# Altium project MHE_Tracker_V3.PrjPcb
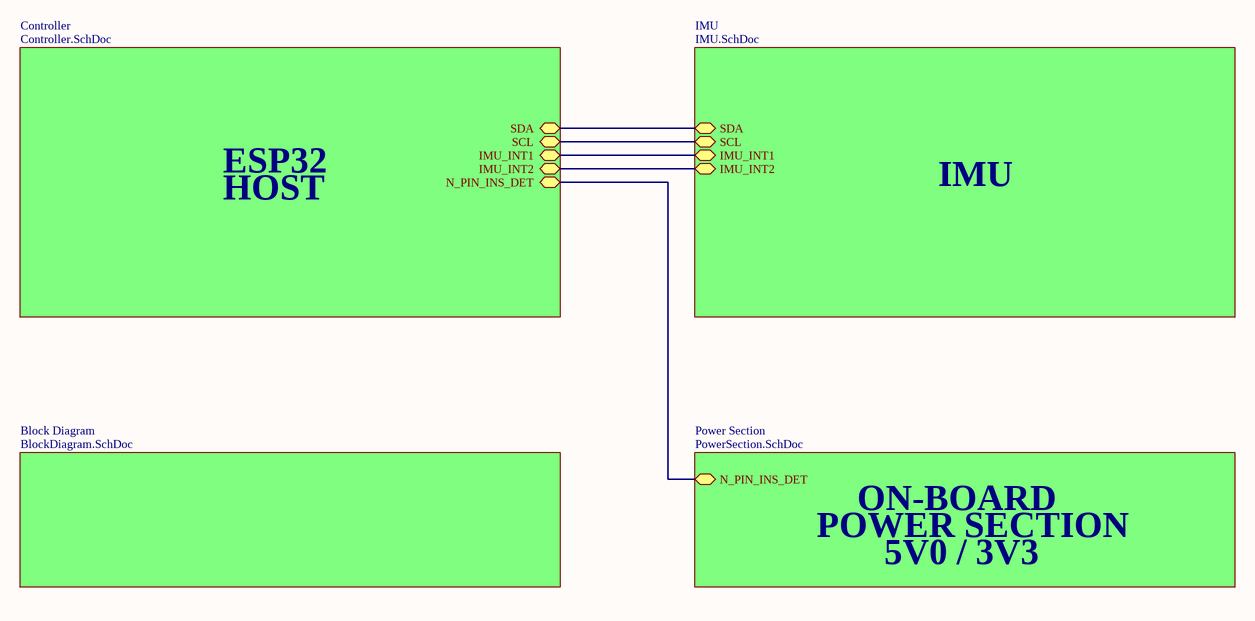
[diagram p0: Architecture.SchDoc]
Project: MHE Tracker V3; Revision: 1.0; SheetTotal: 5
5 sheets, 137 parts. Net scope: hierarchical (ports join the sheet entries above them; power ports are global).
Board file: MHE_Tracker_V3.PcbDoc
Sheets:
  Architecture.SchDoc
    Controller = Controller.SchDoc
    Power Section = PowerSection.SchDoc
    Block Diagram = BlockDiagram.SchDoc
    IMU = IMU.SchDoc

## Sheet Architecture.SchDoc: System Architecture
size 420 x 297 mm; SheetNumber: 1; SheetTotal: 2; DOC_NO_SCH_DWG: 1

### Sub-sheets
Block Diagram = BlockDiagram.SchDoc: no entries
Controller = Controller.SchDoc: SDA (bidir), SCL (bidir), IMU_INT1 (bidir), IMU_INT2 (bidir), N_PIN_INS_DET (bidir)
IMU = IMU.SchDoc: SDA (bidir), SCL (bidir), IMU_INT1 (bidir), IMU_INT2 (bidir)
Power Section = PowerSection.SchDoc: N_PIN_INS_DET (bidir)

### Nets
IMU_INT1: sheet Controller/IMU_INT1, sheet IMU/IMU_INT1
IMU_INT2: sheet Controller/IMU_INT2, sheet IMU/IMU_INT2
N_PIN_INS_DET: sheet Controller/N_PIN_INS_DET, sheet Power Section/N_PIN_INS_DET
SCL: sheet Controller/SCL, sheet IMU/SCL
SDA: sheet Controller/SDA, sheet IMU/SDA

### Notes on the sheet
- HOST
- ESP32
- IMU
- POWER SECTION
- ON-BOARD
- 5V0 / 3V3
- PROJECT
- SIZE
- FILE NAME
- A3
- TITLE
- SHEET
- OF
- REV

## Sheet Controller.SchDoc: Controller Section
size 420 x 297 mm; SheetNumber: 2
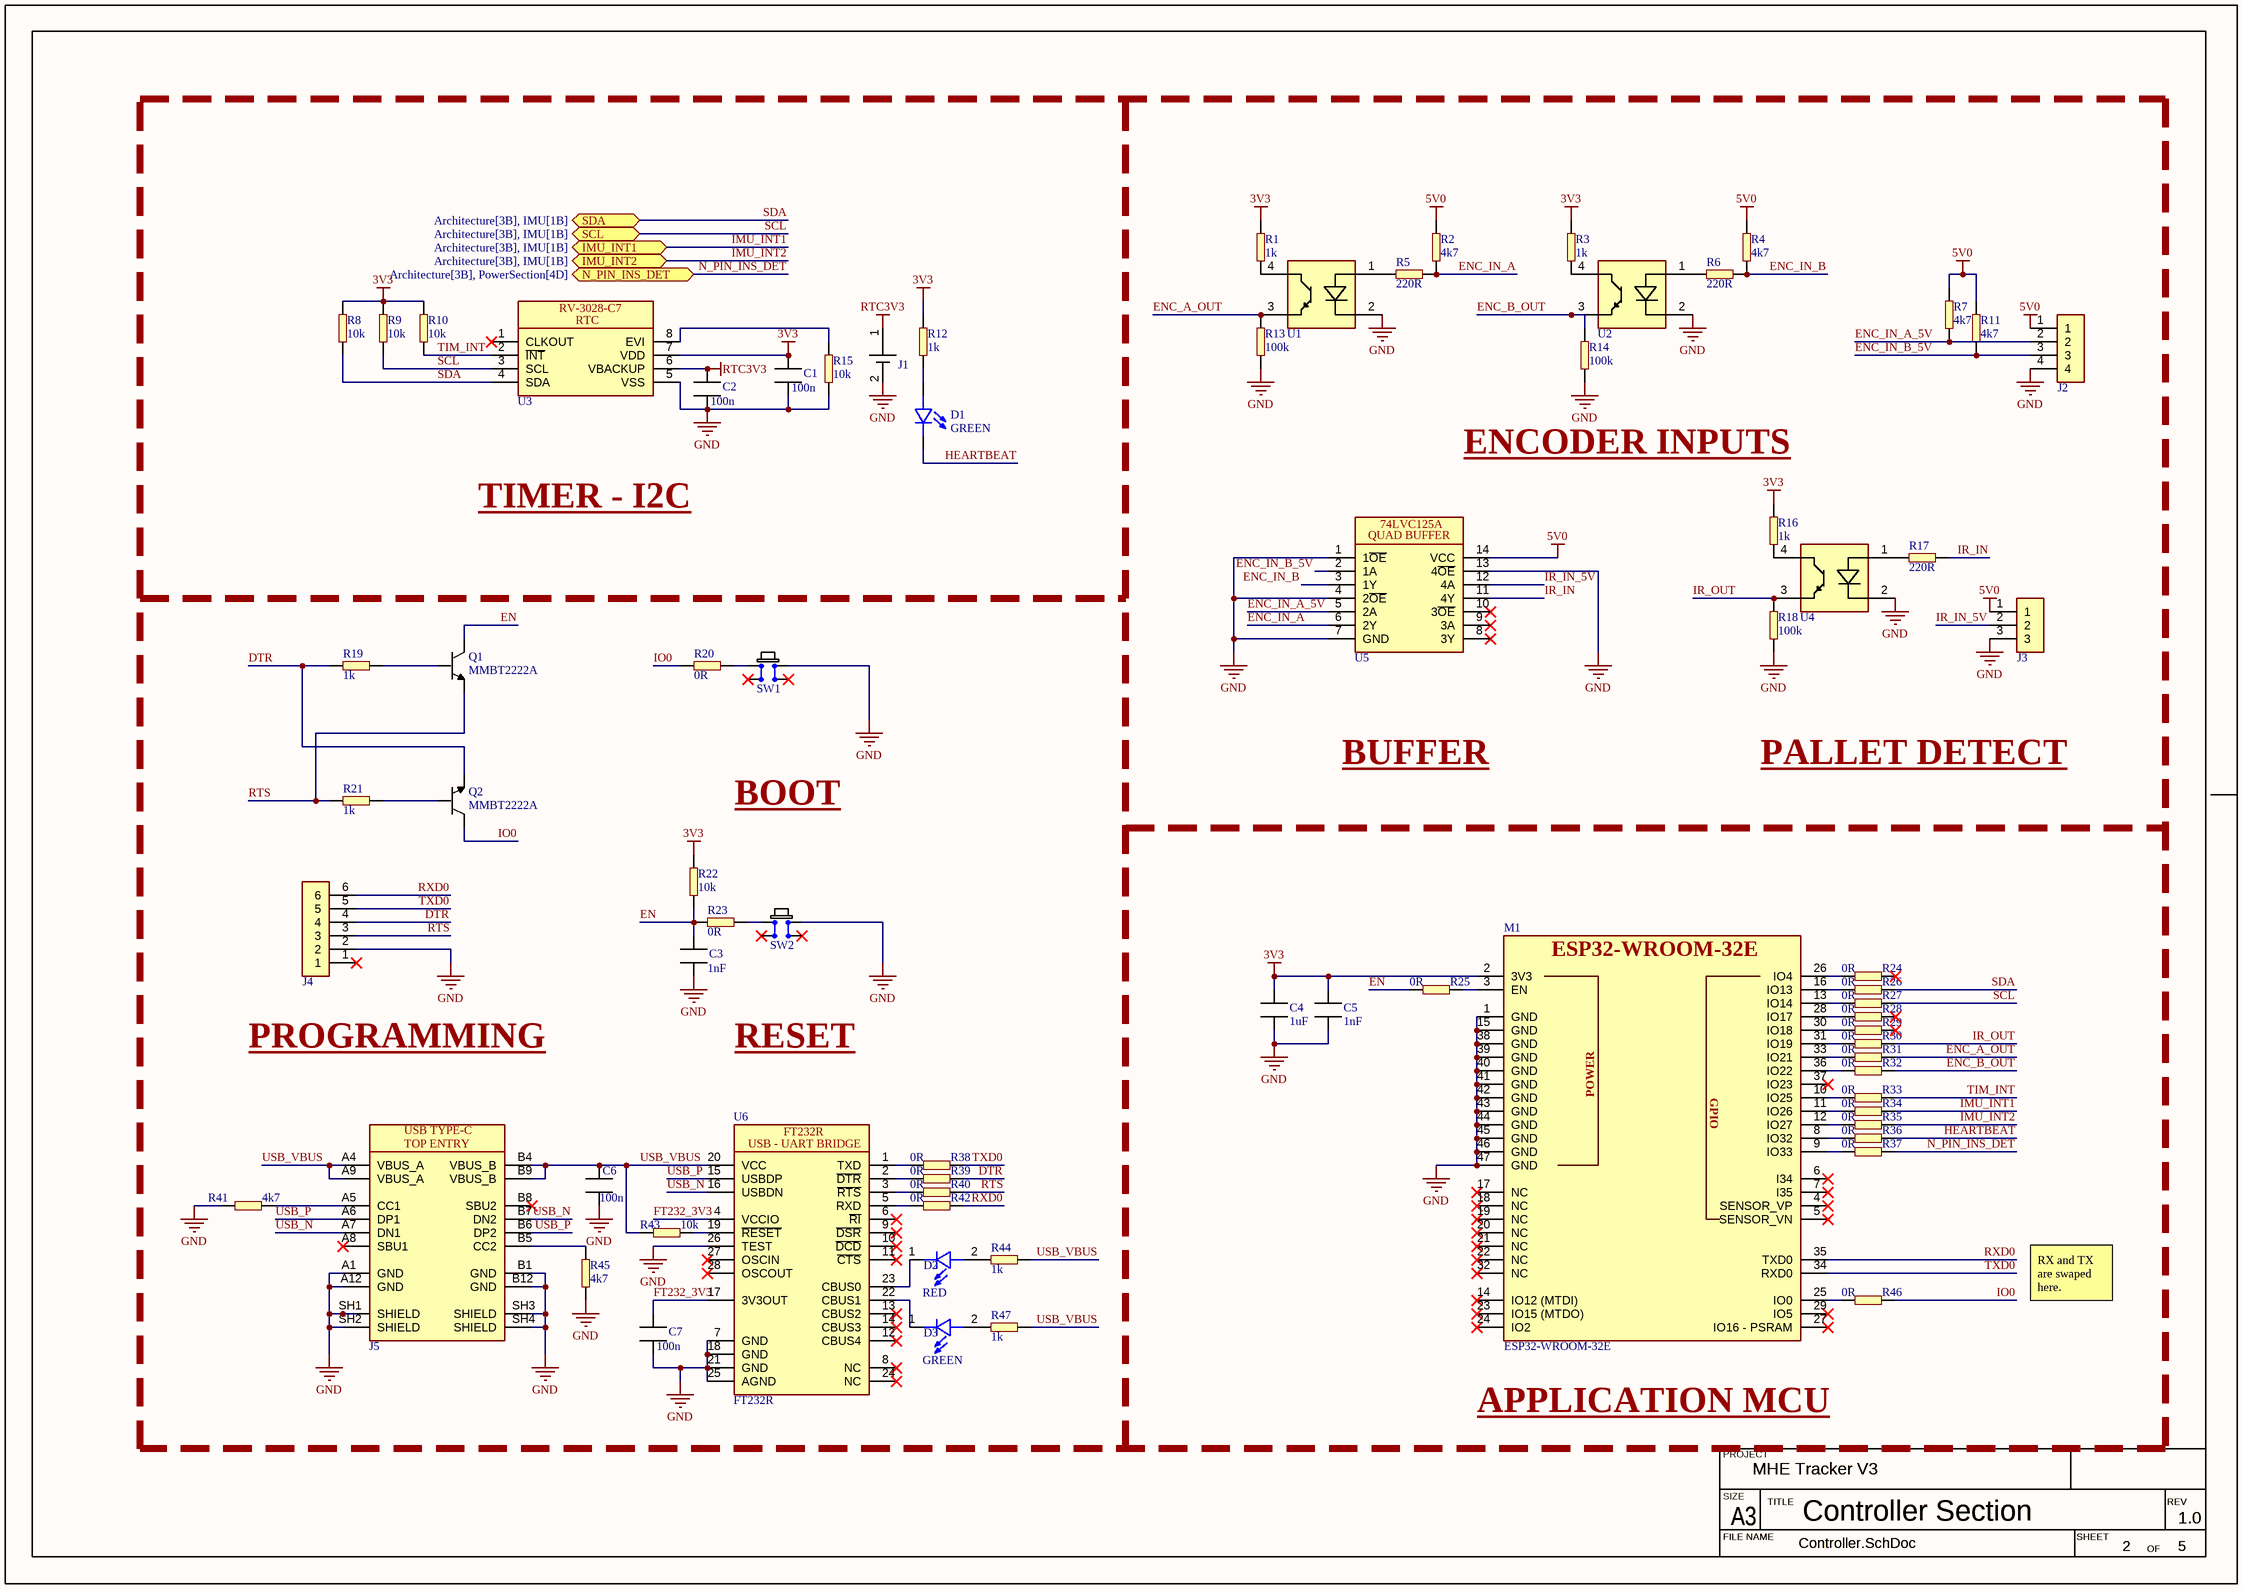
[diagram p1: Controller.SchDoc]

### Parts
(Parts that share a designator on the sheet are numbered #1, #2 ... from top to bottom, then left to right.)
C1  value 100n  [CAPC1608X10N]  (hidden comment: ERP_102-1)
C2  value 100n  [CAPC1608X10N]  (hidden comment: ERP_102-1)
C3  value 1nF  [CAPC1608X10N]  (hidden comment: ERP_102-1)
C4  value 1uF  [CAPC1608X10N]  (hidden comment: ERP_102-1)
C5  value 1nF  [CAPC1608X10N]  (hidden comment: ERP_102-1)
C6  value 100n  [CAPC1608X10N]  (hidden comment: ERP_102-1)
C7  value 100n  [CAPC1608X10N]  (hidden comment: ERP_102-1)
D1  value GREEN  [LED_3MM_GREEN_RIGHT_ANGLE]  (hidden comment: LED_3MM_RIGHT_ANGLE)
D2  value RED  [LED_1206]  (hidden comment: LED_1206)
D3  value GREEN  [LED_1206]  (hidden comment: LED_1206)
J1  CR1220-BH  [CR1220-BH]  (value not drawn)
J2  Terminal_Block_4Pin_5.08P  [4Pin_TerminalBlock_5.08P]  (value not drawn)
J3  Terminal_Block_3Pin_5.08P  [3Pin_TerminalBlock_5.08P]  (value not drawn)
J4  ERP_148-2  [6PX1R_F]  (value not drawn)
J5  GSB1CA11101DSHR  [GSB1CA11101DSHR]  (value not drawn)
M1  ESP32-WROOM-32E  [ESP32-WROOM-32E]
Q1  value MMBT2222A  [MMBT2222]  (hidden comment: ERP_105-1)
Q2  value MMBT2222A  [MMBT2222]  (hidden comment: ERP_105-1)
R1  value 1k  [RES_0603]  (hidden comment: ERP_101-1)
R2  value 4k7  [RES_0603]  (hidden comment: ERP_101-1)
R3  value 1k  [RES_0603]  (hidden comment: ERP_101-1)
R4  value 4k7  [RES_0603]  (hidden comment: ERP_101-1)
R5  value 220R  [RES_0603]  (hidden comment: ERP_101-1)
R6  value 220R  [RES_0603]  (hidden comment: ERP_101-1)
R7  value 4k7  [RES_0603]  (hidden comment: ERP_101-1)
R8  value 10k  [RES_0603]  (hidden comment: ERP_101-1)
R9  value 10k  [RES_0603]  (hidden comment: ERP_101-1)
R10  value 10k  [RES_0603]  (hidden comment: ERP_101-1)
R11  value 4k7  [RES_0603]  (hidden comment: ERP_101-1)
R12  value 1k  [RES_0603]  (hidden comment: ERP_101-1)
R13  value 100k  [RES_0603]  (hidden comment: ERP_101-1)
R14  value 100k  [RES_0603]  (hidden comment: ERP_101-1)
R15  value 10k  [RES_0603]  (hidden comment: ERP_101-1)
R16  value 1k  [RES_0603]  (hidden comment: ERP_101-1)
R17#1  value 220R  [RES_0603]  (hidden comment: ERP_101-1)
R18#1  value 100k  [RES_0603]  (hidden comment: ERP_101-1)
R19#1  value 1k  [RES_0603]  (hidden comment: ERP_101-1)
R20  value 0R  [RES_0603]  (hidden comment: ERP_101-1)
R21  value 1k  [RES_0603]  (hidden comment: ERP_101-1)
R22#1  value 10k  [RES_0603]  (hidden comment: ERP_101-1)
R23#1  value 0R  [RES_0603]  (hidden comment: ERP_101-1)
R24  value 0R  [RES_0603]  (hidden comment: ERP_101-1)
R25  value 0R  [RES_0603]  (hidden comment: ERP_101-1)
R26  value 0R  [RES_0603]  (hidden comment: ERP_101-1)
R27  value 0R  [RES_0603]  (hidden comment: ERP_101-1)
R28  value 0R  [RES_0603]  (hidden comment: ERP_101-1)
R29  value 0R  [RES_0603]  (hidden comment: ERP_101-1)
R30  value 0R  [RES_0603]  (hidden comment: ERP_101-1)
R31#1  value 0R  [RES_0603]  (hidden comment: ERP_101-1)
R32#1  value 0R  [RES_0603]  (hidden comment: ERP_101-1)
R33#1  value 0R  [RES_0603]  (hidden comment: ERP_101-1)
R34#1  value 0R  [RES_0603]  (hidden comment: ERP_101-1)
R35#1  value 0R  [RES_0603]  (hidden comment: ERP_101-1)
R36  value 0R  [RES_0603]  (hidden comment: ERP_101-1)
R37  value 0R  [RES_0603]  (hidden comment: ERP_101-1)
R38  value 0R  [RES_0603]  (hidden comment: ERP_101-1)
R39  value 0R  [RES_0603]  (hidden comment: ERP_101-1)
R40  value 0R  [RES_0603]  (hidden comment: ERP_101-1)
R41  value 4k7  [RES_0603]  (hidden comment: ERP_101-1)
R42  value 0R  [RES_0603]  (hidden comment: ERP_101-1)
R43  value 10k  [RES_0603]  (hidden comment: ERP_101-1)
R44  value 1k  [RES_0603]  (hidden comment: ERP_101-1)
R45  value 4k7  [RES_0603]  (hidden comment: ERP_101-1)
R46  value 0R  [RES_0603]  (hidden comment: ERP_101-1)
R47  value 1k  [RES_0603]  (hidden comment: ERP_101-1)
SW1  Generic6X6  [Generic6X6]  (value not drawn)
SW2  Generic6X6  [Generic6X6]  (value not drawn)
U1  FOD817A3SD  [FOD817A3SD]  (value not drawn)
U2  FOD817A3SD  [FOD817A3SD]  (value not drawn)
U3  RV-3028-C7  [RV-3028-C7]  (value not drawn)
U4#1  FOD817A3SD  [FOD817A3SD]  (value not drawn)
U5  74LVC125A  [SOIC127P600X175-14M]  (value not drawn)
U6#1  FT232R  [SOP65P780X200-28M]

### Ports
IMU_INT1 (bidir, see Architecture[3B], IMU[1B]), IMU_INT2 (bidir, see Architecture[3B], IMU[1B]), N_PIN_INS_DET (bidir, see Architecture[3B], PowerSection[4D]), SCL (bidir, see Architecture[3B], IMU[1B]), SDA (bidir, see Architecture[3B], IMU[1B])

### Nets
3V3: C1.1 C4.2 C5.2 M1.2(3V3) R1.2 R3.2 R8.2 R9.2 R10.2 R12.1 R16.2 R22#1.2 U3.7(VDD)
5V0: J2.1 J3.1 R2.2 R4.2 R7.1 R11.1 U5.14(VCC)
GND: C1.2 C2.2 C3.2 C4.1 C5.1 C6.2 C7.2 J1.2(-) J2.4 J3.3 J4.2 J5.A1(GND) J5.A12(GND) J5.B1(GND) J5.B12(GND) J5.SH1(SHIELD) J5.SH2(SHIELD) J5.SH3(SHIELD) J5.SH4(SHIELD) M1.1(GND) M1.15(GND) M1.38(GND) M1.39(GND) M1.40(GND) M1.41(GND) M1.42(GND) M1.43(GND) M1.44(GND) M1.45(GND) M1.46(GND) M1.47(GND) R13.1 R14.1 R15.1 R18#1.1 R41.2 R45.2 SW1.3(COM) SW2.3(COM) U1.2(CATHODE) U2.2(CATHODE) U3.5(VSS) U4#1.2(CATHODE) U5.1(1~{OE}) U5.4(2~{OE}) U5.7(GND) U5.13(4~{OE}) U6#1.7(GND) U6#1.18(GND) U6#1.21(GND) U6#1.25(AGND) U6#1.26(TEST)
RTC3V3: C2.1 J1.1(+) U3.6(VBACKUP)
DTR: J4.4 Q2.2 R19#1.2 R39.1
EN: C3.1 Q1.3 R22#1.1 R23#1.2 R25.2
ENC_A_OUT: R13.2 R31#1.1 U1.3(EMITTER)
ENC_B_OUT: R14.2 R32#1.1 U2.3(EMITTER)
ENC_IN_A: R2.1 R5.2 U5.6(2Y)
ENC_IN_A_5V: J2.2 R7.2 U5.5(2A)
ENC_IN_B: R4.1 R6.2 U5.3(1Y)
ENC_IN_B_5V: J2.3 R11.2 U5.2(1A)
FT232_3V3: C7.1 U6#1.4(VCCIO) U6#1.17(3V3OUT)
HEARTBEAT: D1.2 R36.1
IMU_INT1: R34#1.1 ; port IMU_INT1
IMU_INT2: R35#1.2 ; port IMU_INT2
IO0: Q2.3 R20.2 R46.1
IR_IN: R17#1.2 U5.11(4Y)
IR_IN_5V: J3.2 U5.12(4A)
IR_OUT: R18#1.2 R30.1 U4#1.3(EMITTER)
N_PIN_INS_DET: R37.1 ; port N_PIN_INS_DET
RTS: J4.3 Q1.2 R21.2 R40.1
RXD0: J4.6 M1.35(TXD0) R42.1
SCL: R9.1 R27.1 U3.3(SCL) ; port SCL
SDA: R8.1 R26.1 U3.4(SDA) ; port SDA
TIM_INT: R10.1 R33#1.1 U3.2(~{INT})
TXD0: J4.5 M1.34(RXD0) R38.1
USB_N: J5.A7(DN1) J5.B7(DN2) U6#1.16(USBDN)
USB_P: J5.A6(DP1) J5.B6(DP2) U6#1.15(USBDP)
USB_VBUS: C6.1 J5.A4(VBUS_A) J5.A9(VBUS_A) J5.B4(VBUS_B) J5.B9(VBUS_B) R43.1 R44.2 R47.2 U6#1.20(VCC)
NetD1_1: D1.1 R12.2
NetD2_1: D2.1 U6#1.23(CBUS0)
NetD2_2: D2.2 R44.1
NetD3_1: D3.1 U6#1.22(CBUS1)
NetD3_2: D3.2 R47.1
NetJ5_A5: J5.A5(CC1) R41.1
NetJ5_B5: J5.B5(CC2) R45.1
NetM1_3: M1.3(EN) R25.1
NetM1_8: M1.8(IO32) R36.2
NetM1_9: M1.9(IO33) R37.2
NetM1_10: M1.10(IO25) R33#1.2
NetM1_11: M1.11(IO26) R34#1.2
NetM1_12: M1.12(IO27) R35#1.1
NetM1_13: M1.13(IO14) R27.2
NetM1_16: M1.16(IO13) R26.2
NetM1_25: M1.25(IO0) R46.2
NetM1_26: M1.26(IO4) R24.2
NetM1_28: M1.28(IO17) R28.2
NetM1_30: M1.30(IO18) R29.2
NetM1_31: M1.31(IO19) R30.2
NetM1_33: M1.33(IO21) R31#1.2
NetM1_36: M1.36(IO22) R32#1.2
NetQ1_1: Q1.1 R19#1.1
NetQ2_1: Q2.1 R21.1
NetR1_1: R1.1 U1.4(COLLECTOR)
NetR3_1: R3.1 U2.4(COLLECTOR)
NetR5_1: R5.1 U1.1(ANODE)
NetR6_1: R6.1 U2.1(ANODE)
NetR15_2: R15.2 U3.8(EVI)
NetR16_1: R16.1 U4#1.4(COLLECTOR)
NetR17#1_1: R17#1.1 U4#1.1(ANODE)
NetR20_1: R20.1 SW1.1(NO)
NetR23#1_1: R23#1.1 SW2.1(NO)
NetR38_2: R38.2 U6#1.1(TXD)
NetR39_2: R39.2 U6#1.2(~{DTR})
NetR40_2: R40.2 U6#1.3(~{RTS})
NetR42_2: R42.2 U6#1.5(RXD)
NetR43_2: R43.2 U6#1.19(~{RESET})

Not connected (* = marked no-connect by the designer): J4 1*; J5 A8(SBU1)* B8(SBU2)*; M1 4(SENSOR_VP)* 5(SENSOR_VN)* 6(I34)* 7(I35)* 14(IO12_(MTDI))* 17(NC)* 18(NC)* 19(NC)* 20(NC)* 21(NC)* 22(NC)* 23(IO15_(MTDO))* 24(IO2)* 27(IO16_-_PSRAM)* 29(IO5)* 32(NC)* 37(IO23)*; R24 1*; R28 1*; R29 1*; SW1 2(NO)* 4(COM)*; SW2 2(NO)* 4(COM)*; U3 1(CLKOUT)*; U5 8(3Y)* 9(3A)* 10(3~{OE})*; U6#1 6(~{RI})* 8(NC)* 9(~{DSR})* 10(~{DCD})* 11(~{CTS})* 12(CBUS4)* 13(CBUS2)* 14(CBUS3)* 24(NC)* 27(OSCIN)* 28(OSCOUT)*

### Notes on the sheet
- ENCODER INPUTS
- TIMER - I2C
- BUFFER
- PALLET DETECT
- BOOT
- PROGRAMMING
- RESET
- RX and TX are swaped here.
- APPLICATION MCU
- PROJECT
- SIZE
- FILE NAME
- A3
- TITLE
- SHEET
- OF
- REV
- (in symbol 74LVC125A) QUAD BUFFER
- (in symbol ESP32-WROOM-32E) POWER; GPIO
- (in symbol FT232R) USB - UART BRIDGE
- (in symbol GSB1CA11101DSHR) USB TYPE-C; TOP ENTRY
- (in symbol RV-3028-C7) RTC

### Library data of the parts
C1 C2 C6 C7 = MLCC_0603: MLCC 0603; Package: 0603; Manufacturer Part Number 1: *; Suuplier Part Number 1: *; ERP: *
  C2: Manufacturer 1: *
C3 = MLCC_0603: MLCC 0603; Manufacturer 1: Samsung Electro-Mechanics; Manufacturer Part Number 1: CL10C102JB8NNNC; Package: 0603; Suuplier Part Number 1: *; ERP: *; Supplier 1: Digikey; Supplier Part Number 1: 1276-1091-1-ND
C4 C5 = MLCC_0603: MLCC 0603; Manufacturer 1: Samsung Electro-Mechanics; Manufacturer Part Number 1: CL10A105KB8NNNC; Package: 0603; Supplier 1: *; Suuplier Part Number 1: *; ERP: *
D1 = LED_3MM_RIGHT_ANGLE: LED_3MM
D2 D3 = LED_1206: LED CLEAR 1206 SMD; Manufacturer Part Number 1: *; Manufacturer 1: *
J1 = CR1220-BH: BATTERY HOLDER COIN 12.5MM SMD; Manufacturer 1: Keystone Electronics; Value: *; Manufacturer Part Number 1: *
J2 = Terminal_Block_4Pin_5.08P: 6PINS TERMINAL BLOCK 5.08 PITCH; Manufacturer Part Number 1: *; Manufacturer 1: *; Supplier Part Number 1: *; Supplier 1: *; ERP: *; Package: 6PIN
J3 = Terminal_Block_3Pin_5.08P: 6PINS TERMINAL BLOCK 5.08 PITCH; Manufacturer Part Number 1: *; Manufacturer 1: *; Supplier Part Number 1: *; Supplier 1: *; ERP: *; Package: 6PIN
J4 = 6PX1R_F: 6PX1R Female Header; Value: *; Manufacturer 1: *; Manufacturer Part Number 1: *
J5 = GSB1CA11101DSHR: USB-C (USB TYPE-C) USB 2.0 Receptacle Connector 24 (16+8 Dummy) Position Surface Mount, Through Hole; Manufacturer 1: Amphenol ICC (Commercial Products); Value: MUP-U23010-02; Manufacturer Part Number 1: GSB1CA11101DSHR; Package: 24 (16+8 Dummy)
M1 = ESP32-WROOM-32E: ESP32-WROOM-32E Module; Manufacturer 1: Espressif Systems; Manufacturer Part Number 1: *; Package: *; Value: ESP32-WROOM-32E
Q1 Q2 = MMBT2222: MMBT2222A; Manufacturer Part Number 1: MMBT2222A-7-F; Manufacturer 1: Diotec Semiconductor; ERP: *; Suuplier Part Number 1: *; Supplier 1: *; Package: SOT23
R1-R7 R11 R12 R16 R17#1 R19#1 R21 R22#1 R44 R47 = RES_0603: Manufacturer 1: YAGEO; Manufacturer Part Number 1: RC0603FR-071KL; Package: 0603; ERP: *
R8-R10 R15 R18#1 R41 R43 R45 = RES_0603: Package: 0603; Manufacturer 1: *; Manufacturer Part Number 1: *
  R8-R10 R15: Supplier 1: *; Supplier Part Number 1: *; ERP: *
  R18#1: ERP: *
R13 R14 = RES_0603: Manufacturer Part Number 1: RC0603FR-07100KL; Package: 0603; Manufacturer 1: *; ERP: *
R20 R23#1 R24-R30 R31#1 R32#1 R33#1 R34#1 R35#1 R36-R40 R42 R46 = RES_0603: Manufacturer 1: YAGEO; Manufacturer Part Number 1: RC0603JR-07470RL; Package: 0603; ERP: *; Supplier 1: *; Supplier Part Number 1: *; Supplier 2: Digikey; Supplier Part Number 2: 311-470GRCT-ND
SW1 SW2 = Generic6X6: Tactile Switch SPST-NO Top Actuated Surface Mount; Manufacturer Part Number 1: 5558; Manufacturer 1: Sharvi; Package: 6X6
U1 U2 U4#1 = FOD817A3SD: OPTOISOLATOR 5KV TRANSISTOR 4SMD; Manufacturer: onsemi; Value: *; Manufacturer Part Number 1: FOD817A3SD
U3 = RV-3028-C7: IC RTC CLK/CALENDAR I2C 8SON; Manufacturer 1: Micro Crystal AG; Manufacturer Part Number 1: RV-3028-C7 32.768KHZ 1PPM-TA-QC; Value: *
U5 = 74LVC125A: Buffer, Non-Inverting 4 Element 1 Bit per Element 3-State Output 14-DHVQFN (2.5x3); Manufacturer Part Number 1: ST2103SD1678; Manufacturer 1: Sharvi; Value: *
U6#1 = FT232R: USB to Serial UART, USB to UART, 1.8 → 5 V, 28-Pin SSOP; Manufacturer 1: Sharvi; Manufacturer Part Number 1: ST2009SD0267; Value: FT232R

## Sheet PowerSection.SchDoc: Power Section
size 420 x 297 mm; SheetNumber: 3
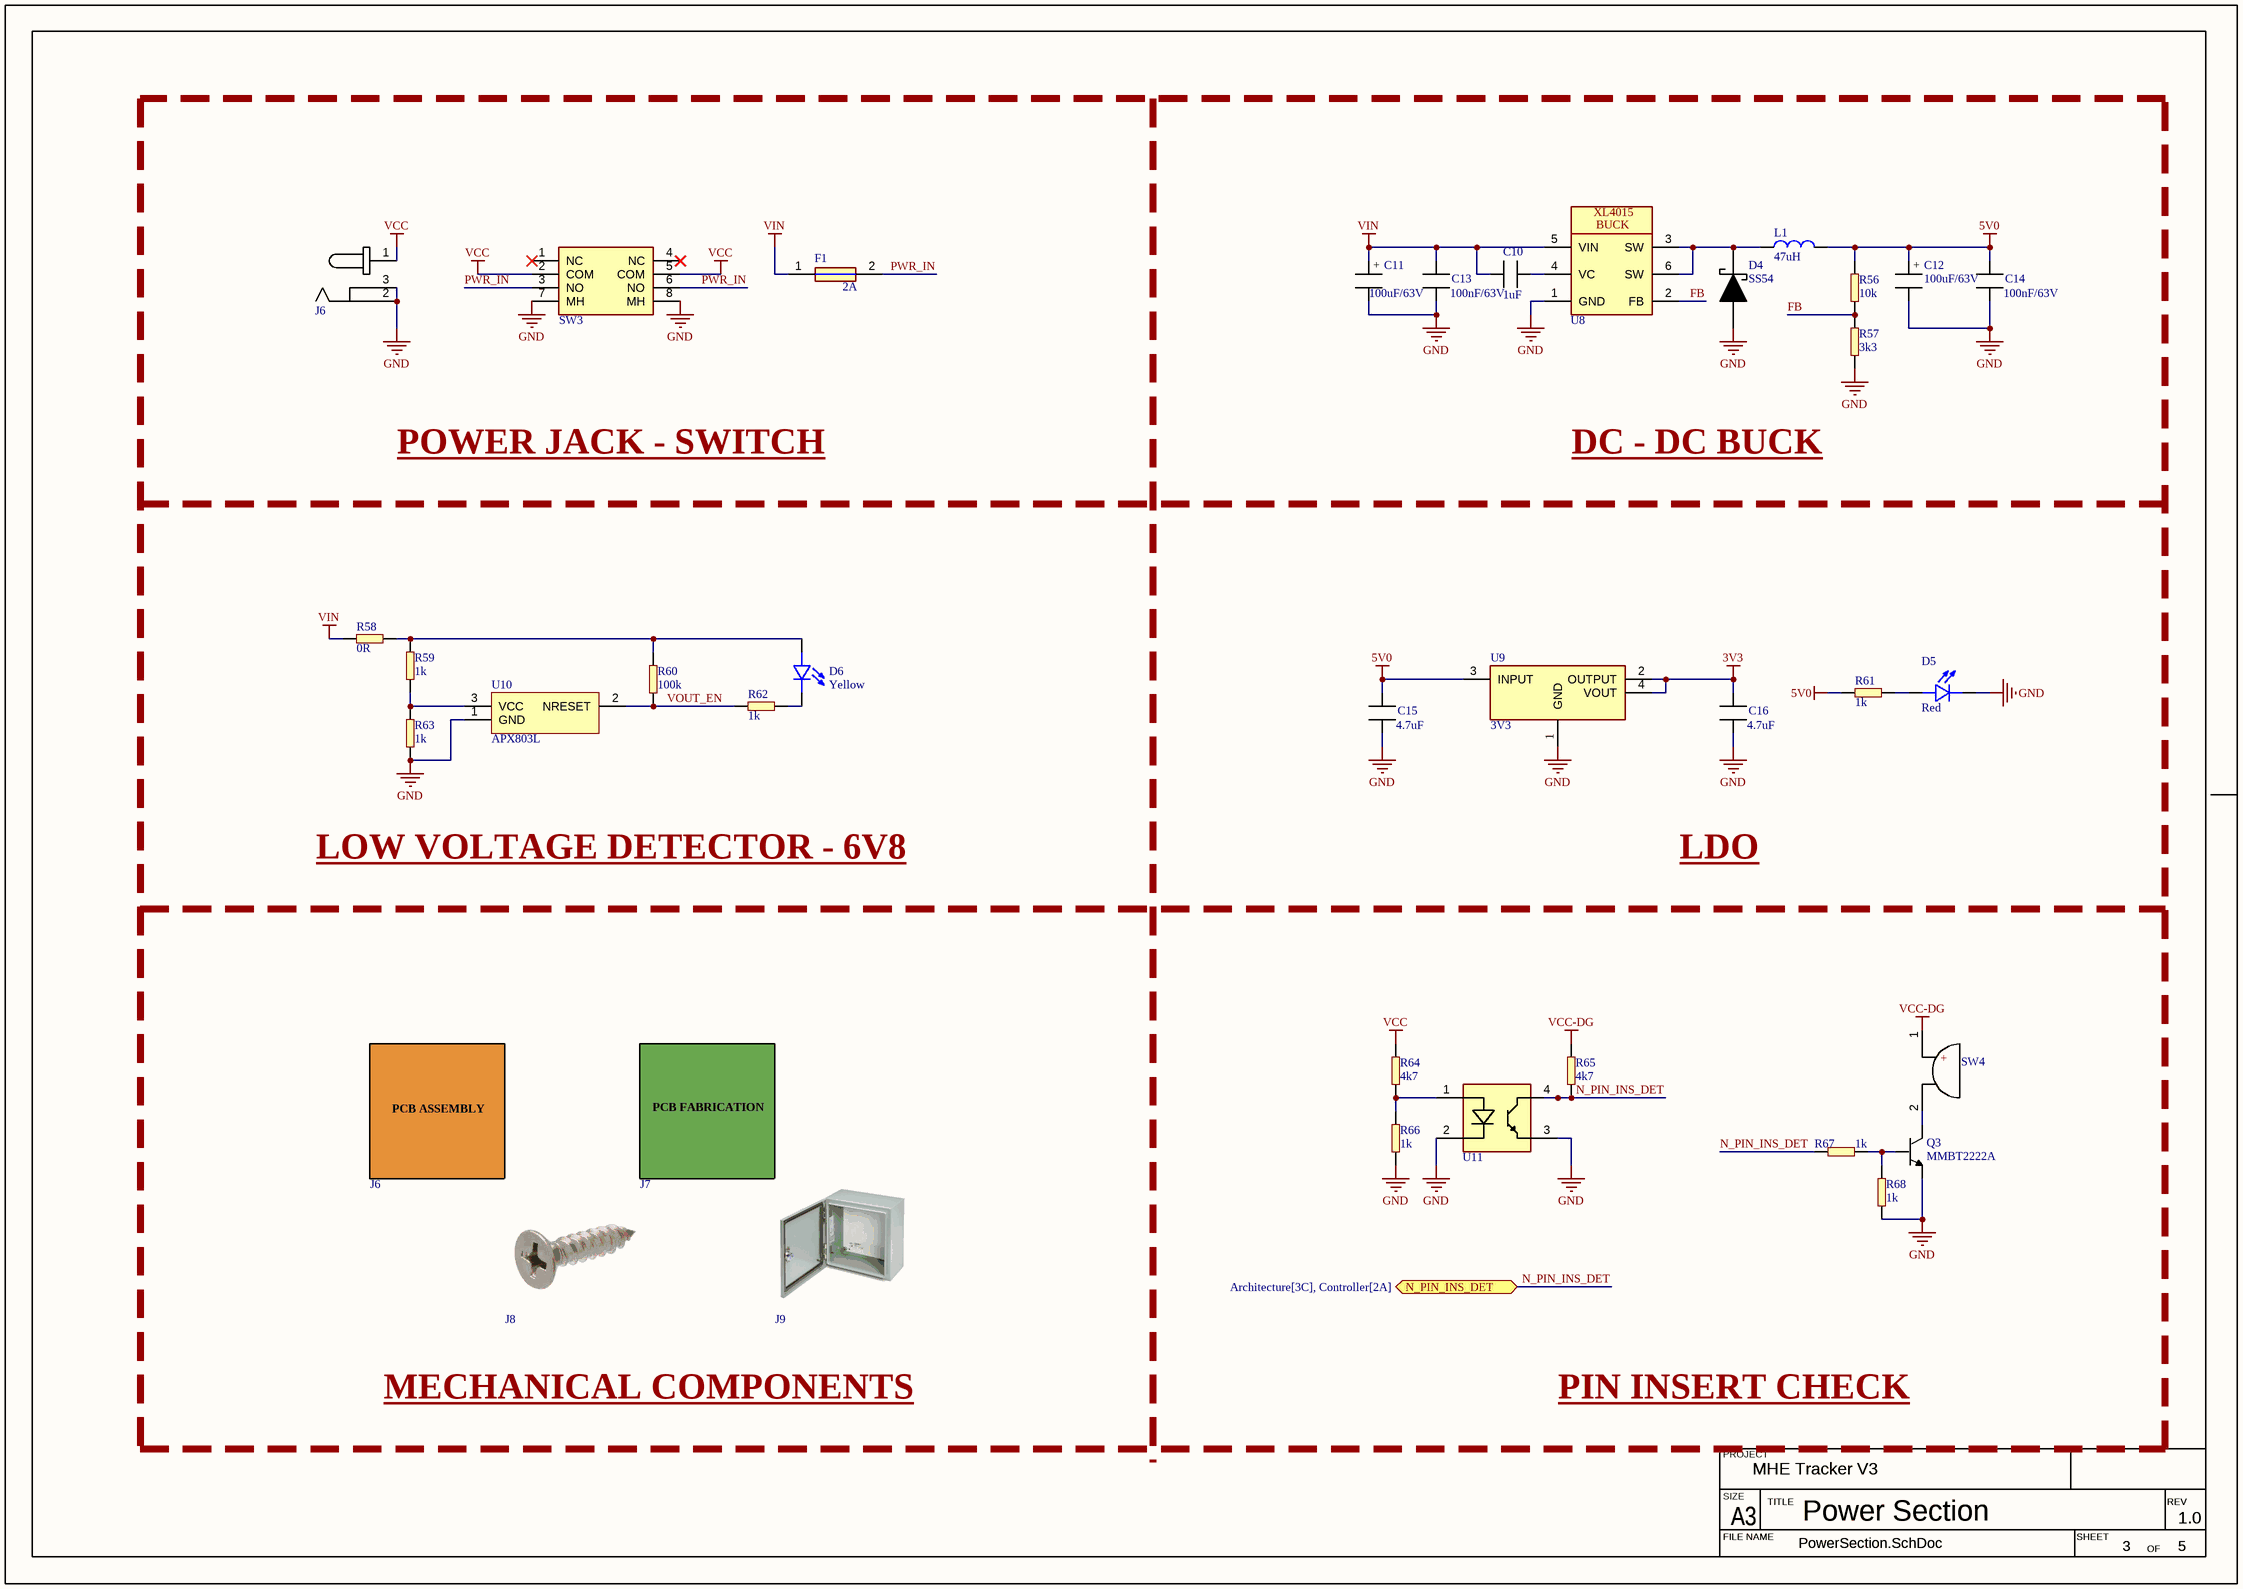
[diagram p2: PowerSection.SchDoc]

### Parts
(Parts that share a designator on the sheet are numbered #1, #2 ... from top to bottom, then left to right.)
C10#1  value 1uF  [CAPC1608X10N]  (hidden comment: ERP_102-1)
C11#1  value 100uF/63V  [CAP_D12.5_H21_P5]  (hidden comment: ERP_102-2)
C12  value 100uF/63V  [CAP_D12.5_H21_P5]  (hidden comment: ERP_102-2)
C13  value 100nF/63V  [CAPC1608X10N]  (hidden comment: ERP_102-1)
C14#1  value 100nF/63V  [CAPC1608X10N]  (hidden comment: ERP_102-1)
C15#1  value 4.7uF  [CAPC1608X10N]  (hidden comment: ERP_102-1)
C16  value 4.7uF  [CAPC1608X10N]  (hidden comment: ERP_102-1)
D4  value SS54  [DIOM6959X26L]  (hidden comment: ERP_104-3)
D5  value Red  [LED_3MM_RED_RIGHT_ANGLE]  (hidden comment: LED_3MM_RIGHT_ANGLE)
D6  value Yellow  [LED_3MM_YELLOW_RIGHT_ANGLE]  (hidden comment: LED_3MM_RIGHT_ANGLE)
F1  value 2A  [0679L]  (hidden comment: 0679L)
J6#1  KLDX-0202-AC  [KLDX-0202-AC]  (value not drawn)
J6#2  APCB  (value not drawn)  (graphical)
J7  BPCB  (value not drawn)  (graphical)
J8  SCREW  (value not drawn)  (graphical)
J9  ENCLOSURE  (value not drawn)  (graphical)
L1  value 47uH  [IND_1212]  (hidden comment: ERP_103-3)
Q3  value MMBT2222A  [MMBT2222]  (hidden comment: ERP_105-1)
R56  value 10k  [RES_0603]  (hidden comment: ERP_101-1)
R57  value 3k3  [RES_0603]  (hidden comment: ERP_101-1)
R58  value 0R  [RES_0603]  (hidden comment: ERP_101-1)
R59  value 1k  [RES_0603]  (hidden comment: ERP_101-1)
R60  value 100k  [RES_0603]  (hidden comment: ERP_101-1)
R61  value 1k  [RES_0603]  (hidden comment: ERP_101-1)
R62  value 1k  [RES_0603]  (hidden comment: ERP_101-1)
R63  value 1k  [RES_0603]  (hidden comment: ERP_101-1)
R64  value 4k7  [RES_0603]  (hidden comment: ERP_101-1)
R65  value 4k7  [RES_0603]  (hidden comment: ERP_101-1)
R66  value 1k  [RES_0603]  (hidden comment: ERP_101-1)
R67  value 1k  [RES_0603]  (hidden comment: ERP_101-1)
R68  value 1k  [RES_0603]  (hidden comment: ERP_101-1)
SW3  ERP_110-4  [PBH2U]  (value not drawn)
SW4  ERP_110-4  [ActiveBuzzer12MM]  (value not drawn)
U8  XL4015  [XL4015]  (value not drawn)
U9  value 3V3  [AMS1117_SOT223]  (hidden comment: ERP_123-1)
U10  APX803L  [APX803L]
U11  FOD817A3SD  [FOD817A3SD]  (value not drawn)

### Ports
N_PIN_INS_DET (bidir, see Architecture[3C], Controller[2A])

### Nets
3V3: C16.1 U9.2(OUTPUT) U9.4(VOUT)
5V0: C12.1 C14#1.1 C15#1.1 L1.2 R56.2 R61.1 U9.3(INPUT)
GND: C11#1.2 C12.2 C13.2 C14#1.2 C15#1.2 C16.2 D4.2(A) D5.2 J6#1.2 J6#1.3 Q3.2 R57.1 R63.1 R66.1 R68.2 SW3.7(MH) SW3.8(MH) U8.1(GND) U9.1(GND) U10.1(GND) U11.2(CATHODE) U11.3(EMITTER)
VCC: J6#1.1 R64.2 SW3.2(COM) SW3.5(COM)
VCC-DG: R65.2 SW4.1(+)
VIN: C10#1.1 C11#1.1 C13.1 F1.1 R58.2 U8.5(VIN)
FB: R56.1 R57.2 U8.2(FB)
N_PIN_INS_DET: R65.1 R67.2 U11.4(COLLECTOR) ; port N_PIN_INS_DET
PWR_IN: F1.2 SW3.3(NO) SW3.6(NO)
VOUT_EN: R60.1 R62.1 U10.2(NRESET)
NetC10#1_2: C10#1.2 U8.4(VC)
NetD4_1: D4.1(C) L1.1 U8.3(SW) U8.6(SW)
NetD5_1: D5.1 R61.2
NetD6_1: D6.1 R58.1 R59.2 R60.2
NetD6_2: D6.2 R62.2
NetQ3_1: Q3.1 R67.1 R68.1
NetQ3_3: Q3.3 SW4.2(-)
NetR59_1: R59.1 R63.2 U10.3(VCC)
NetR64_1: R64.1 R66.2 U11.1(ANODE)

Not connected (* = marked no-connect by the designer): SW3 1(NC)* 4(NC)*

### Notes on the sheet
- POWER JACK - SWITCH
- DC - DC BUCK
- LOW VOLTAGE DETECTOR - 6V8
- LDO
- MECHANICAL COMPONENTS
- PIN INSERT CHECK
- PROJECT
- SIZE
- FILE NAME
- A3
- TITLE
- SHEET
- OF
- REV
- (in symbol APCB) PCB ASSEMBLY
- (in symbol BPCB) PCB FABRICATION
- (in symbol CAP_D12.5_H21_P5) +
- (in symbol XL4015) BUCK

### Library data of the parts
C10#1 C13 C14#1 = MLCC_0603: Chip Capacitor, 2-Leads, Body 1.60x0.80mm, IPC Medium Density; Package: 0603; Manufacturer 1: *; Manufacturer Part Number 1: *; Supplier 1: *; Suuplier Part Number 1: *; ERP: *
C11#1 C12 = CAP_D12.5_H21_P5: Electrolytic Capacitor Through Hole D12.5 P5.0; Manufacturer 1: Sharvi; Manufacturer Part Number 1: ST2136CO4725; Package: 12.5X5; Supplier 1: *
C15#1 C16 = MLCC_0603: MLCC 0603; Manufacturer 1: Murata; Manufacturer Part Number 1: GRM188R6YA475KE15D; Package: 0603; Suuplier Part Number 1: *; ERP: *; Supplier 1: Digikey; Supplier Part Number 1: 490-7205-1-ND
D4 = SS54: Manufacturer Part Number 1: ST2103SD0940; Manufacturer 1: Sharvi; Supplier Part Number 1: *; Supplier  1: *; Package: SMC; ERP: *
D5 D6 = LED_3MM_RIGHT_ANGLE: LED_3MM
F1 = 0679L: FUSE BRD MNT 2SMD; Manufacturer Part Number 1: ST2103SD1995; Manufacturer 1: Sharvi
J6#1 = KLDX-0202-AC: CONN PWR JACK 2X5.5MM KINKED PIN; Manufacturer 1: Sharvi; Manufacturer Part Number 1: ST2001CO0701; Value: NA
J6#2 = APCB: Assembled PCB; Value: *; Manufacturer 1: *; Manufacturer Part Number 1: *
J7 = BPCB: Bare PCB; Manufacturer Part Number 1: *; Manufacturer 1: *; Value: *
J8 = SCREW: Mounting Screw
J9 = ENCLOSURE: PCB Enclosure; Manufacturer Part Number 1: *; Manufacturer 1: *; Value: *
L1 = IND_1212: Manufacturer Part Number 1: ST2103SD1710; Manufacturer 1: Sharvi
Q3 = MMBT2222: MMBT2222A; ERP: *; Suuplier Part Number 1: *; Supplier 1: *; Manufacturer Part Number 1: *; Manufacturer 1: *; Package: SOT23
R56 = RES_0603: Manufacturer 1: YAGEO; Manufacturer Part Number 1: RC0603FR-07301KL; Package: 0603; Supplier 1: *; Supplier Part Number 1: *; ERP: *
R57 = RES_0603: Manufacturer 1: YAGEO; Manufacturer Part Number 1: RC0603FR-0757K6L; Package: 0603; Supplier 1: *; Supplier Part Number 1: *; ERP: *
R58 R59 R61-R65 R67 R68 = RES_0603: as R1 on sheet Controller; Package: 0603; ERP: *
R60 R66 = RES_0603: as R13 on sheet Controller; Package: 0603; Manufacturer 1: *; ERP: *
  R60: Supplier 1: *; Supplier Part Number 1: *
SW3 = PBH2U: Pushbutton Switch DPDT Standard Through Hole, Right Angle; Manufacturer Part Number 1: ST2106CO3161; Manufacturer 1: Sharvi; Package: *; Value: *
SW4 = ActiveBuzzer12MM: SWITCH SLIDE SPDT 200MA 30V; Manufacturer Part Number 1: 4149; Manufacturer 1: Sunrom; Value: *
U8 = XL4015: 5A 180KHz 36V Buck DC to DC Converter; Manufacturer 1: Sharvi; Manufacturer Part Number 1: ST2103SD1331; Value: *
U9 = AMS1117_SOT223: AMS1117 LDO; Supplier  Part Number 1: *; Supplier  1: *; Package: SOT223; Manufacturer Part Number 1: *; Manufacturer 1: *; ERP: *
U10 = APX803L: IC SUPERVISOR 1 CHANNEL SOT23; Manufacturer Part Number 1: APX803L20-35SA-7; Manufacturer 1: Diodes Incorporated; Value: APX803L
U11 = FOD817A3SD: as U1 on sheet Controller; Value: *; Manufacturer Part Number 1: FOD817A3SD

## Sheet BlockDiagram.SchDoc
size 420 x 297 mm; SheetNumber: 4

### Notes on the sheet
- PROJECT
- SIZE
- FILE NAME
- A3
- TITLE
- SHEET
- OF
- REV

## Sheet IMU.SchDoc: IMU
size 420 x 297 mm; SheetNumber: 5
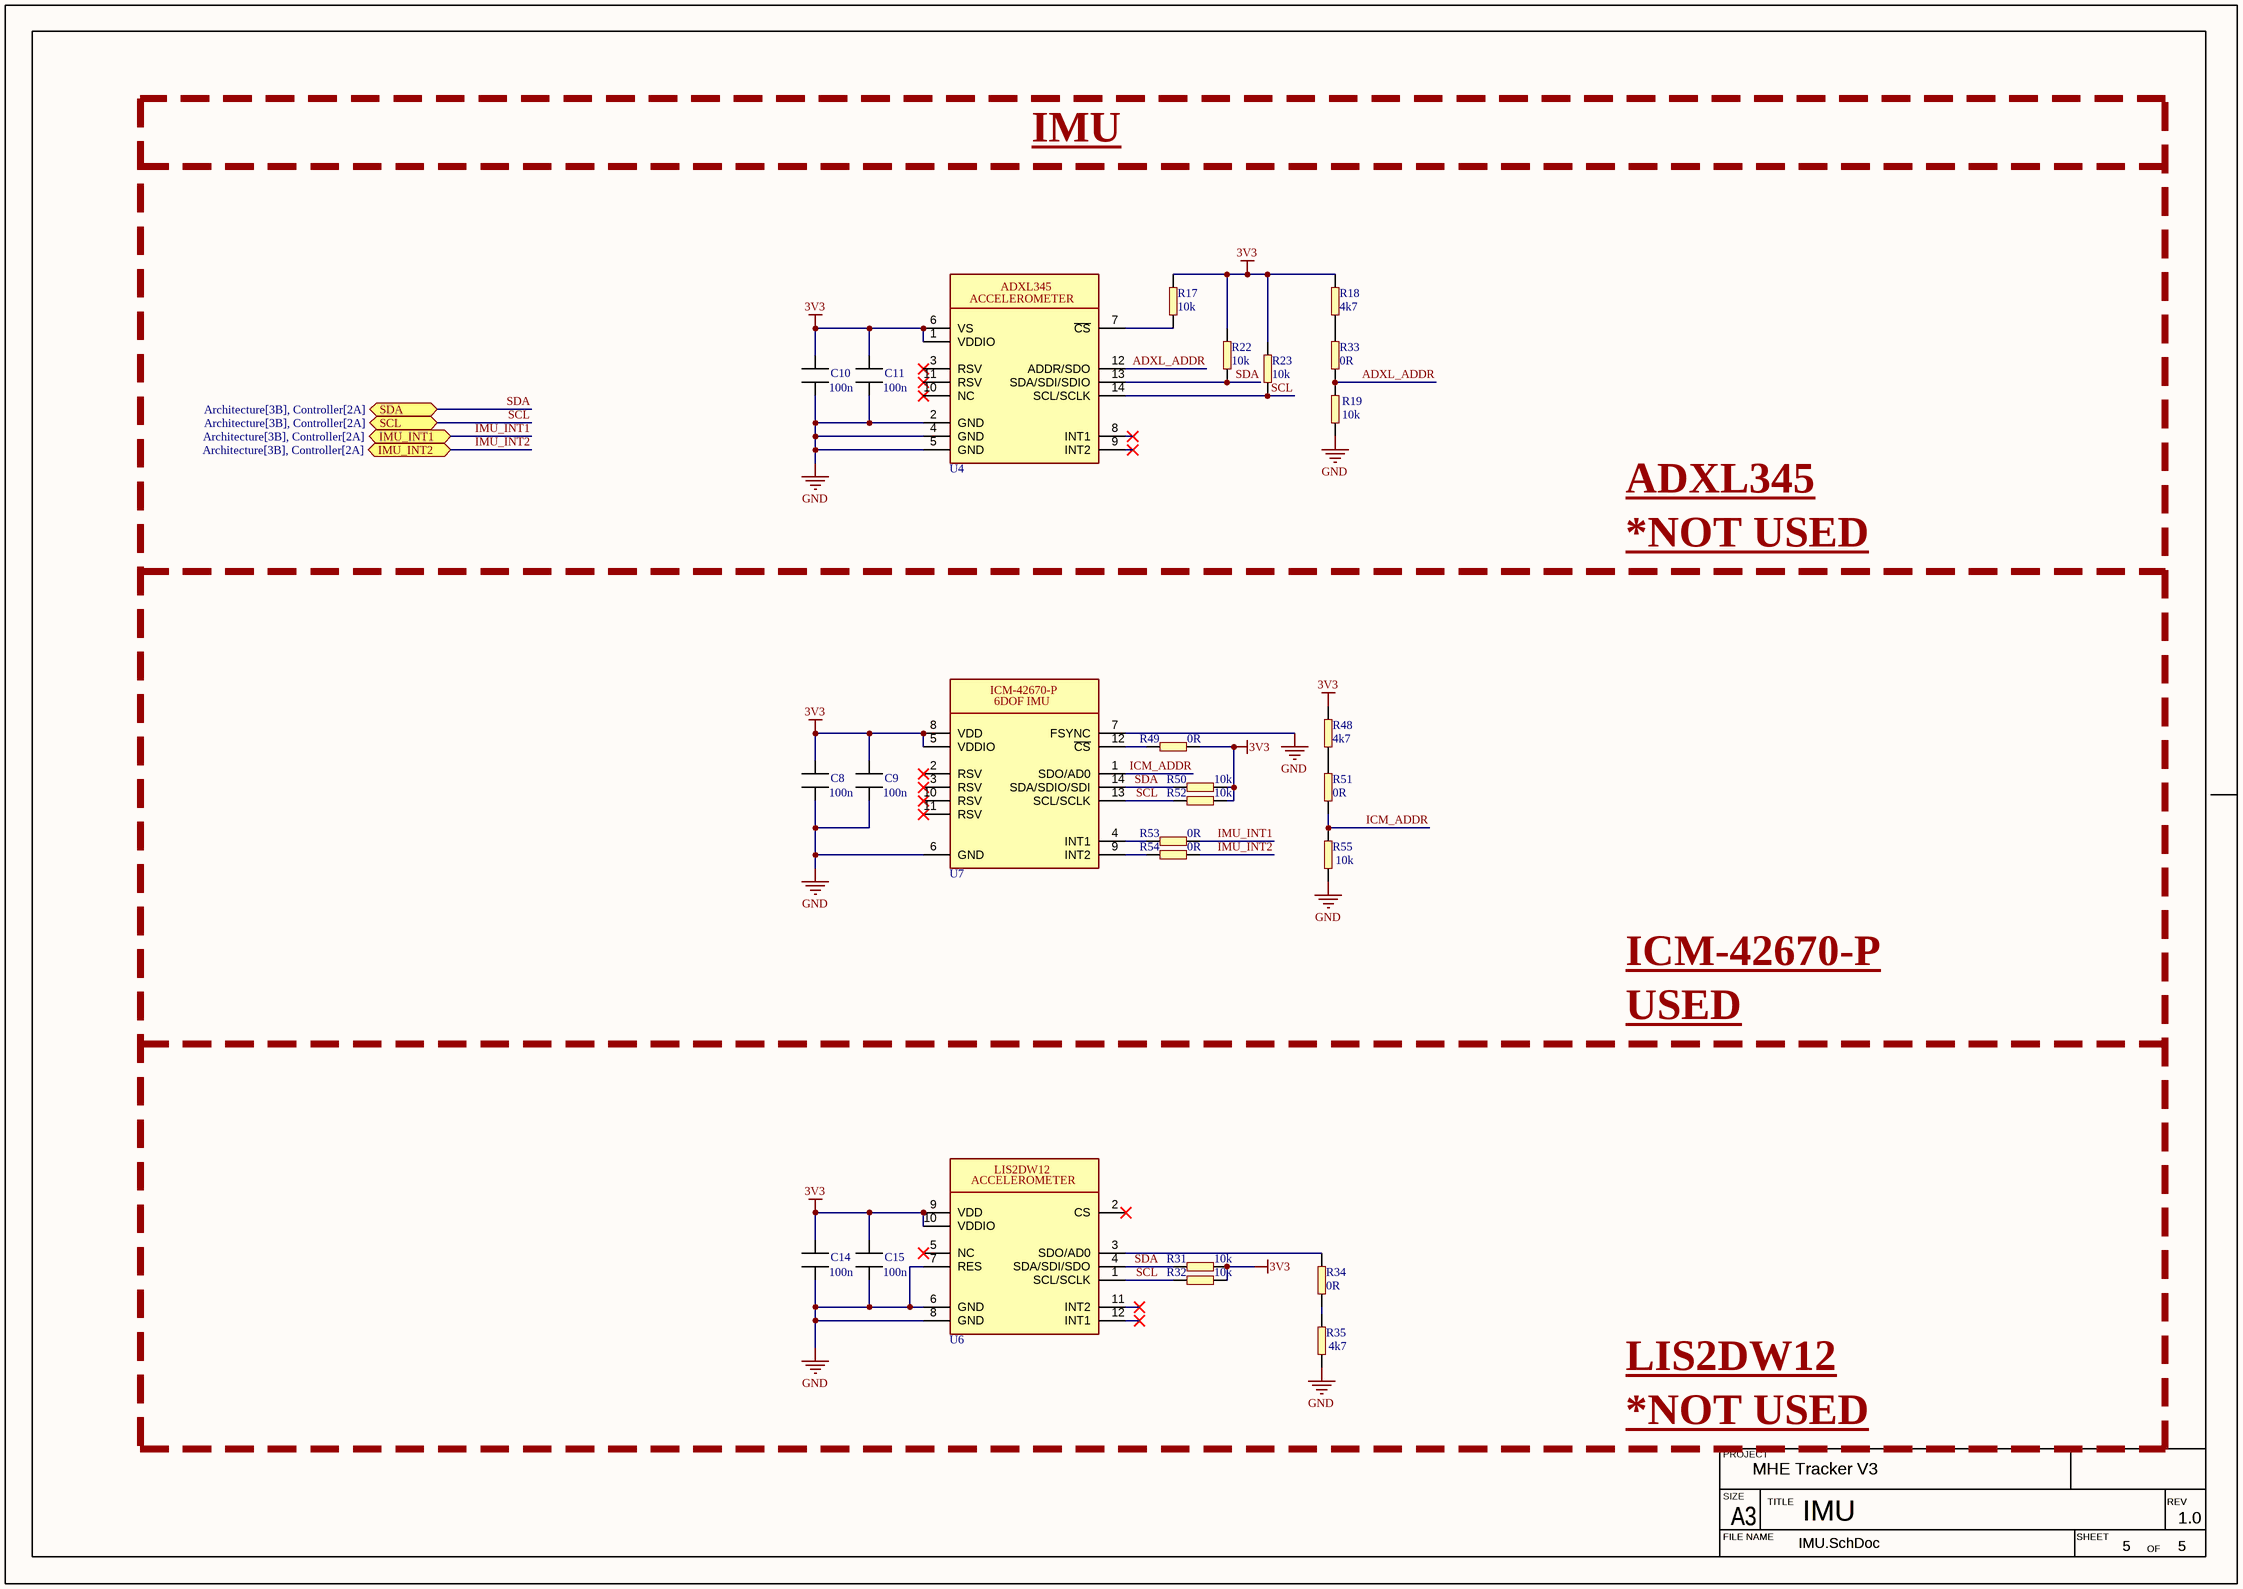
[diagram p3: IMU.SchDoc]

### Parts
(Parts that share a designator on the sheet are numbered #1, #2 ... from top to bottom, then left to right.)
C8  value 100n  [CAPC1608X10N]  (hidden comment: ERP_102-1)
C9  value 100n  [CAPC1608X10N]  (hidden comment: ERP_102-1)
C10#2  value 100n  [CAPC1608X10N]  (hidden comment: ERP_102-1)  (graphical)
C11#2  value 100n  [CAPC1608X10N]  (hidden comment: ERP_102-1)  (graphical)
C14#2  value 100n  [CAPC1608X10N]  (hidden comment: ERP_102-1)  (graphical)
C15#2  value 100n  [CAPC1608X10N]  (hidden comment: ERP_102-1)  (graphical)
R17#2  value 10k  [RES_0603]  (hidden comment: ERP_101-1)  (graphical)
R18#2  value 4k7  [RES_0603]  (hidden comment: ERP_101-1)  (graphical)
R19#2  value 10k  [RES_0603]  (hidden comment: ERP_101-1)  (graphical)
R22#2  value 10k  [RES_0603]  (hidden comment: ERP_101-1)  (graphical)
R23#2  value 10k  [RES_0603]  (hidden comment: ERP_101-1)  (graphical)
R31#2  value 10k  [RES_0603]  (hidden comment: ERP_101-1)  (graphical)
R32#2  value 10k  [RES_0603]  (hidden comment: ERP_101-1)  (graphical)
R33#2  value 0R  [RES_0603]  (hidden comment: ERP_101-1)  (graphical)
R34#2  value 0R  [RES_0603]  (hidden comment: ERP_101-1)  (graphical)
R35#2  value 4k7  [RES_0603]  (hidden comment: ERP_101-1)  (graphical)
R48  value 4k7  [RES_0603]  (hidden comment: ERP_101-1)
R49  value 0R  [RES_0603]  (hidden comment: ERP_101-1)
R50  value 10k  [RES_0603]  (hidden comment: ERP_101-1)
R51  value 0R  [RES_0603]  (hidden comment: ERP_101-1)  (no BOM)
R52  value 10k  [RES_0603]  (hidden comment: ERP_101-1)
R53  value 0R  [RES_0603]  (hidden comment: ERP_101-1)
R54  value 0R  [RES_0603]  (hidden comment: ERP_101-1)
R55  value 10k  [RES_0603]  (hidden comment: ERP_101-1)
U4#2  ADXL345  [ADXL345]  (value not drawn)  (graphical)
U6#2  LIS2DW12  [LIS2DW12]  (value not drawn)  (graphical)
U7  ICM42670P  [ICM42670P]  (value not drawn)

### Ports
IMU_INT1 (bidir, see Architecture[3B], Controller[2A]), IMU_INT2 (bidir, see Architecture[3B], Controller[2A]), SCL (bidir, see Architecture[3B], Controller[2A]), SDA (bidir, see Architecture[3B], Controller[2A])

### Nets
3V3: C8.1 C9.1 C10#2.1 C11#2.1 C14#2.1 C15#2.1 R17#2.2 R18#2.2 R22#2.2 R23#2.2 R31#2.1 R32#2.1 R48.2 R49.1 R50.1 R52.1 U4#2.1(VDDIO) U4#2.6(VS) U6#2.9(VDD) U6#2.10(VDDIO) U7.5(VDDIO) U7.8(VDD)
GND: C8.2 C9.2 C10#2.2 C11#2.2 C14#2.2 C15#2.2 R19#2.1 R35#2.1 R55.1 U4#2.2(GND) U4#2.4(GND) U4#2.5(GND) U6#2.6(GND) U6#2.7(RES) U6#2.8(GND) U7.6(GND) U7.7(FSYNC)
ADXL_ADDR: R19#2.2 R33#2.1 U4#2.12(ADDR/SDO)
ICM_ADDR: R51.1 R55.2 U7.1(SDO/AD0)
IMU_INT1: R53.1 ; port IMU_INT1
IMU_INT2: R54.1 ; port IMU_INT2
SCL: R23#2.1 R32#2.2 R52.2 U4#2.14(SCL/SCLK) U6#2.1(SCL/SCLK) U7.13(SCL/SCLK) ; port SCL
SDA: R22#2.1 R31#2.2 R50.2 U4#2.13(SDA/SDI/SDIO) U6#2.4(SDA/SDI/SDO) U7.14(SDA/SDIO/SDI) ; port SDA
NetR17#2_1: R17#2.1 U4#2.7(~{CS})
NetR18#2_1: R18#2.1 R33#2.2
NetR34#2_1: R34#2.1 R35#2.2
NetR34#2_2: R34#2.2 U6#2.3(SDO/AD0)
NetR48_1: R48.1 R51.2
NetR49_2: R49.2 U7.12(~{CS})
NetR53_2: R53.2 U7.4(INT1)
NetR54_2: R54.2 U7.9(INT2)

Not connected (* = marked no-connect by the designer): U4#2 3(RSV)* 8(INT1)* 9(INT2)* 10(NC)* 11(RSV)*; U6#2 2(CS)* 5(NC)* 11(INT2)* 12(INT1)*; U7 2(RSV)* 3(RSV)* 10(RSV)* 11(RSV)*

### Notes on the sheet
- IMU
- ADXL345
- *NOT USED
- ICM-42670-P
- USED
- LIS2DW12
- PROJECT
- SIZE
- FILE NAME
- A3
- TITLE
- SHEET
- OF
- REV
- (in symbol ADXL345) ACCELEROMETER
- (in symbol ICM42670P) 6DOF IMU
- (in symbol LIS2DW12) ACCELEROMETER

### Library data of the parts
C8 C9 C10#2 C11#2 C14#2 C15#2 = MLCC_0603: as C10#1 on sheet PowerSection; Package: 0603; Manufacturer 1: *; Manufacturer Part Number 1: *; Supplier 1: *; Suuplier Part Number 1: *; ERP: *
R17#2 R18#2 R19#2 R22#2 R23#2 R31#2 R32#2 R33#2 R34#2 R35#2 R48-R55 = RES_0603: Package: 0603; Manufacturer 1: *; Manufacturer Part Number 1: *; Supplier 1: *; Supplier Part Number 1: *; ERP: *
U4#2 = ADXL345: ACCEL 2-16G I2C/SPI 14LGA; Manufacturer 1: Analog Devices Inc.; Manufacturer Part Number 1: ADXL345BCCZ-RL7; Value: *
U6#2 = LIS2DW12: ACCEL 2-16G I2C/SPI 12LGA; Manufacturer 1: STMicroelectronics; Value: *; Manufacturer Part Number 1: *
U7 = ICM42670P: IMU ACCEL/GYRO/TEMP I2C/SPI; Manufacturer Part Number 1: ICM-42670-P; Manufacturer 1: TDK InvenSense; Value: *

## Nets that join several sheets
3V3: Controller (13 pins), PowerSection (C16.1 U9.2 U9.4), IMU (22 pins)
5V0: Controller (7 pins), PowerSection (7 pins)
GND: Controller (52 pins), PowerSection (22 pins), IMU (17 pins)
IMU_INT1: Controller (R34#1.1), IMU (R53.1)
IMU_INT2: Controller (R35#1.2), IMU (R54.1)
N_PIN_INS_DET: Controller (R37.1), PowerSection (R65.1 R67.2 U11.4)
SCL: Controller (R9.1 R27.1 U3.3), IMU (6 pins)
SDA: Controller (R8.1 R26.1 U3.4), IMU (6 pins)